# Altium schematic sheet LM1117_3.3V_Reg.SchDoc
size B
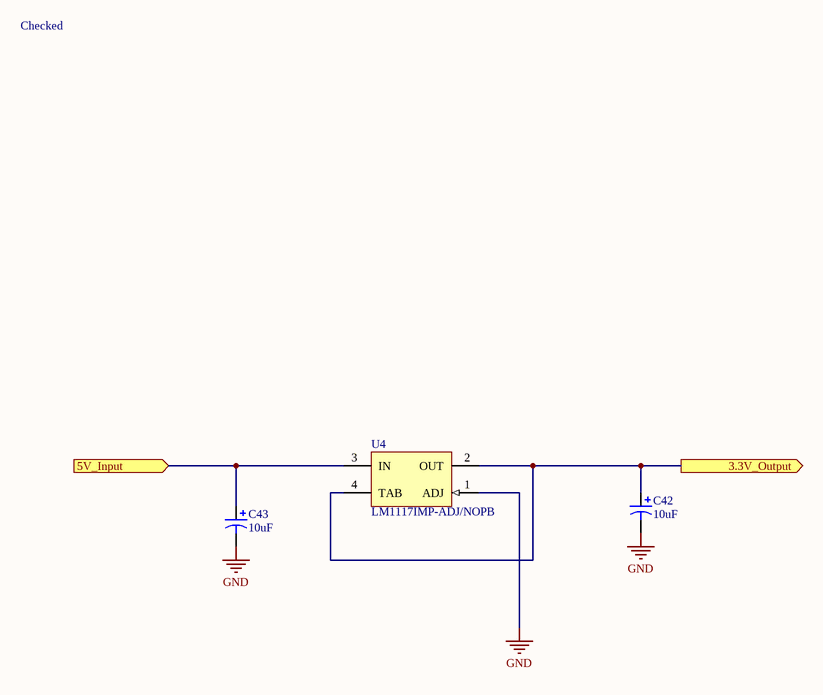
[diagram p0: LM1117_3.3V_Reg.SchDoc]

## Parts
C42  value 10uF  [CAPACITOR_3MM]  (hidden comment: Pol)
C43  value 10uF  [CAPACITOR_3MM]  (hidden comment: Pol)
U4  LM1117IMP-ADJ/NOPB  [MP04A_L]

## Ports
3.3V_Output (out), 5V_Input (in)

## Nets
GND: C42.2 C43.2 U4.1(ADJ)
3.3V_Output: C42.1 U4.2(OUT) U4.4(TAB) ; port 3.3V_Output
5V_Input: C43.1 U4.3(IN) ; port 5V_Input

## Notes on the sheet
- Checked
- ESE
- is the sole property of ESE. Any reproduction
- The Information Contained in this drawing
- Schematic P/N and Name
- Sheet Name
- 299 Doon Valley Drive
- Kitchener, ON N2G 4M4
- Canada
- Approved
- in part or in whole without the written
- permission of ESE is strictly prohibited.
- APPROVALS
- DATE
- Size
- Scale
- B
- NTS
- Bare PCB P/N
- Date
- Sheet
- Rev.
- Engineer
- of

## Library data of the parts
C42 C43 = Cap Polar-0.1uF-50V: CAP 85C 0.1uF ±20% 50V WX Series Aluminum Electrolytic; MPN: UWX1H0R1MCL2GB; Tan Theta: 0.12; Leakage Current: 3; Rated Ripple Current: 1; PN: 493-2121-1-ND; Name: Cap Polar-0.1uF-50V; Diameter: 3; URL: http://www.digikey.ca/product-detail/en/UWX1C100MCL2GB/493-2099-2-ND/589840
U4 = LM1117IMP-ADJ/NOPB: 800mA Low-Dropout Linear Regulator, 4-pin SOT-223, Pb-Free; Manufacturer: National Semiconductor; MPN: LM1117MP-3.3/NOPB; PackageTopMarking: XYTT*N03B; PowerWise: N; CompType: LDO IC; PN: LM1117MP-3.3/NOPBCT-ND; Published: 1-Mar-2010; DatasheetVersion: Apr-2006; PackageVersion: revB, Apr-2003; PackageReference: MP04A; Publisher: Altium Limited; PackageDescription: Molded SOT-223, 6.50 x 3.56 x 1.6mm Body, 4 Lead, 2.3mm Pitch; Supplier 1: Digi-Key; Supplier Part Number 1: LM1117IMP-ADJTR-ND; Supplier 2: Digi-Key; Supplier Part Number 2: LM1117IMP-ADJCT-ND; Supplier 3: Digi-Key; Supplier Part Number 3: LM1117IMP-ADJDKR-ND; Supplier 4: Farnell; Supplier Part Number 4: 1469050; PartNumber: LM1117IMP-ADJ/NOPB; RoHS: Y; PinCount: 4; Code_JEDEC: TO-261-AA; Code_IPC: SOT223-4; ComponentLink1Description: LM1117 Datasheet; ComponentLink1URL: http://www.national.com/ds/LM/LM1117.pdf; ComponentLink2Description: LM1117 Web Page; ComponentLink2URL: http://www.national.com/pf/LM/LM1117.html; ComponentLink3Description: MP04A Package Page; ComponentLink3URL: http://www.national.com/packaging/folders/mp04a.html; URL: http://www.digikey.ca/product-detail/en/LM1117MP-3.3%2FNOPB/LM1117MP-3.3%2FNOPBCT-ND